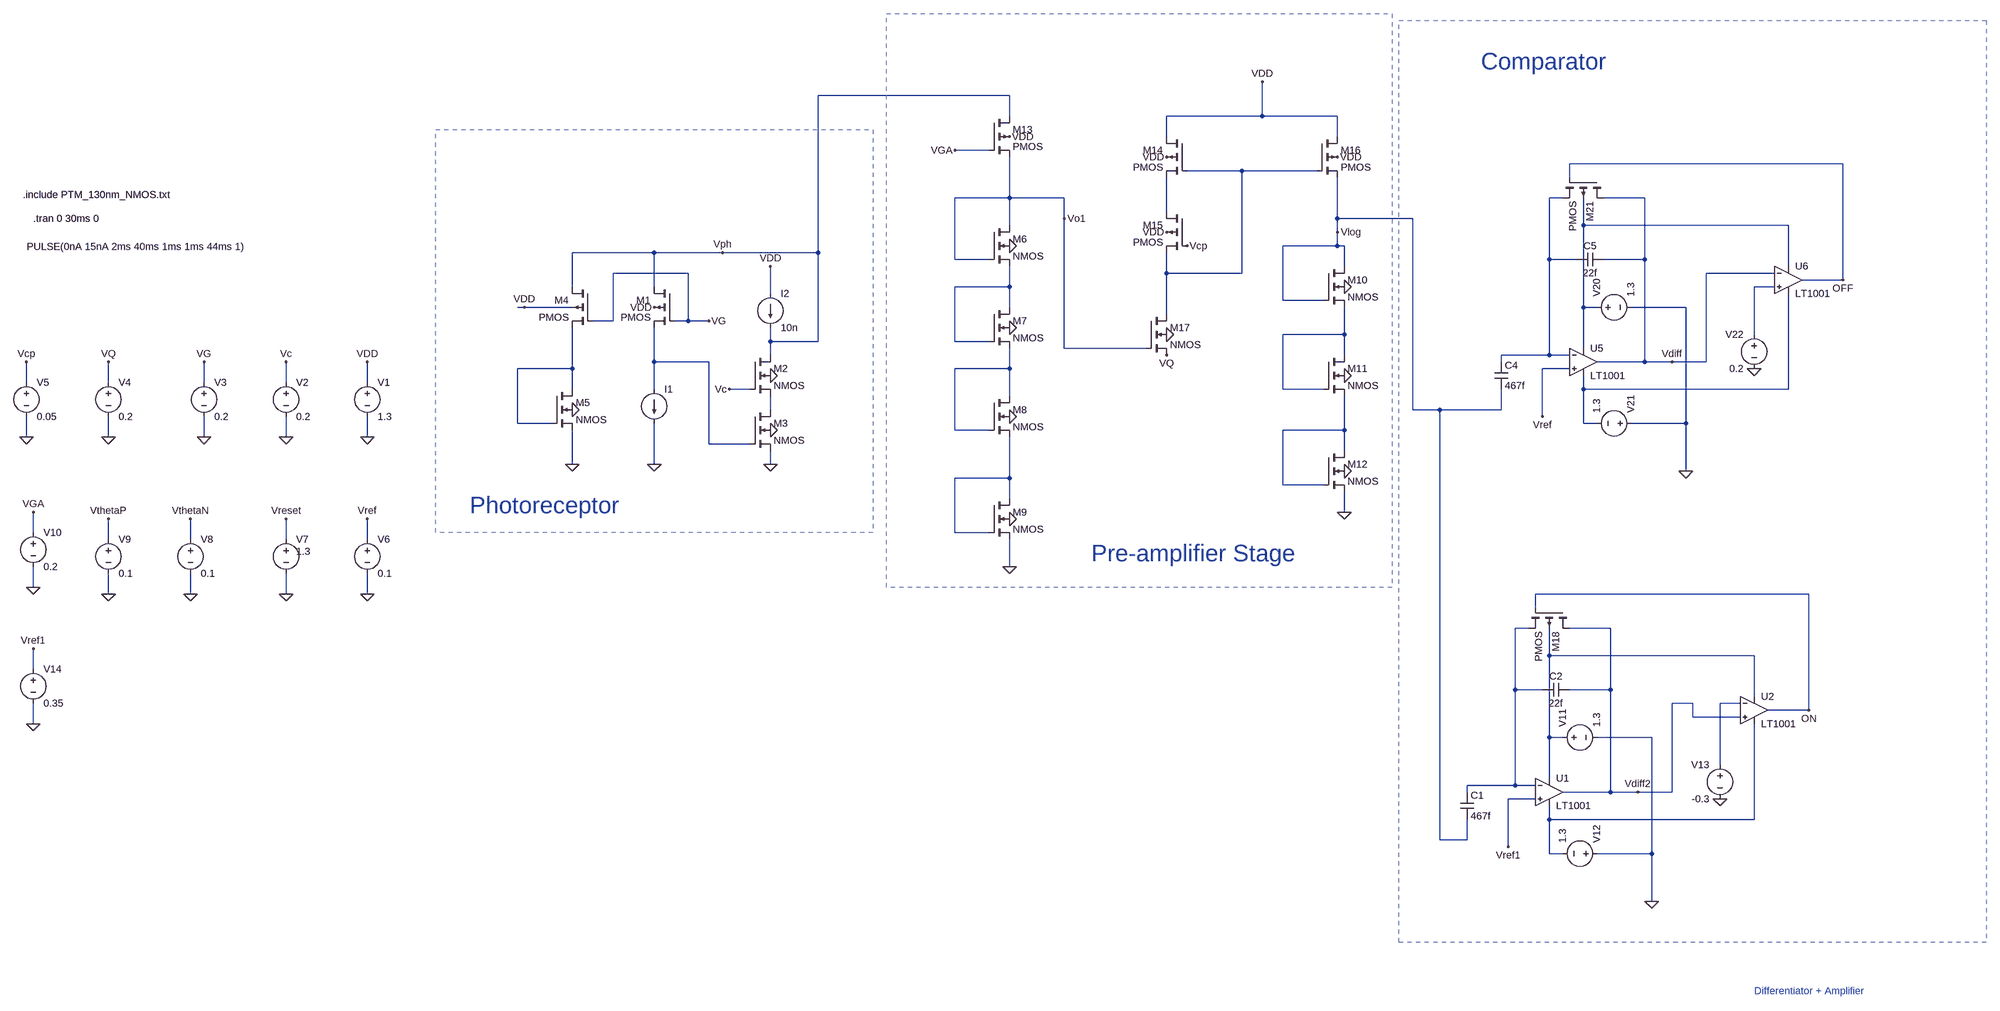
[diagram p0: schematic DAVIS.asc]
DAVIS.asc, the LTspice schematic file:
Version 4
SHEET 1 6216 2696
WIRE 752 -528 304 -528
WIRE 752 -480 752 -528
WIRE 1344 -480 1344 -560
WIRE 1344 -480 1120 -480
WIRE 1520 -480 1344 -480
WIRE 1120 -432 1120 -480
WIRE 1520 -432 1520 -480
WIRE 704 -400 624 -400
WIRE 2704 -368 2064 -368
WIRE 1296 -352 1168 -352
WIRE 1472 -352 1296 -352
WIRE 2064 -336 2064 -368
WIRE 752 -288 752 -384
WIRE 752 -288 624 -288
WIRE 880 -288 752 -288
WIRE 2048 -288 2016 -288
WIRE 2240 -288 2144 -288
WIRE 1120 -256 1120 -336
WIRE 880 -240 880 -288
WIRE 1520 -240 1520 -336
WIRE 1696 -240 1520 -240
WIRE 752 -224 752 -288
WIRE 2096 -224 2096 -288
WIRE 2576 -224 2096 -224
WIRE 1520 -208 1520 -240
WIRE 1520 -176 1520 -208
WIRE 1520 -176 1392 -176
WIRE 1536 -176 1520 -176
WIRE -80 -160 -272 -160
WIRE 80 -160 -80 -160
WIRE 304 -160 304 -528
WIRE 304 -160 80 -160
WIRE 624 -144 624 -288
WIRE 704 -144 624 -144
WIRE 2016 -144 2016 -288
WIRE 2080 -144 2016 -144
WIRE 2240 -144 2240 -288
WIRE 2240 -144 2144 -144
WIRE 1536 -128 1536 -176
WIRE 2576 -128 2576 -224
WIRE 0 -112 -176 -112
WIRE 1120 -112 1120 -160
WIRE 1296 -112 1296 -352
WIRE 1296 -112 1120 -112
WIRE 2544 -112 2384 -112
WIRE 2704 -96 2704 -368
WIRE 2704 -96 2608 -96
WIRE -272 -80 -272 -160
WIRE -80 -80 -80 -160
WIRE 752 -80 752 -128
WIRE 752 -80 624 -80
WIRE 2544 -80 2496 -80
WIRE 192 -64 192 -128
WIRE 1392 -48 1392 -176
WIRE 1488 -48 1392 -48
WIRE -384 -32 -400 -32
WIRE -272 -32 -384 -32
WIRE 752 -32 752 -80
WIRE 2096 -32 2096 -224
WIRE 2128 -32 2096 -32
WIRE 2336 -32 2208 -32
WIRE 1120 -16 1120 -112
WIRE -176 0 -176 -112
WIRE -176 0 -224 0
WIRE 0 0 0 -112
WIRE 0 0 -32 0
WIRE 48 0 0 0
WIRE 1536 32 1536 -32
WIRE 1536 32 1392 32
WIRE 2496 32 2496 -80
WIRE 192 48 192 16
WIRE 304 48 304 -160
WIRE 304 48 192 48
WIRE 624 48 624 -80
WIRE 704 48 624 48
WIRE 880 64 880 -240
WIRE 1072 64 880 64
WIRE 2096 64 2096 -32
WIRE 192 80 192 48
WIRE 1536 80 1536 32
WIRE 2016 80 2016 -144
WIRE 2016 80 1904 80
WIRE 2064 80 2016 80
WIRE -80 96 -80 16
WIRE 48 96 -80 96
WIRE 1904 96 1904 80
WIRE 2240 96 2240 -144
WIRE 2240 96 2128 96
WIRE 2304 96 2240 96
WIRE 2384 96 2384 -112
WIRE 2384 96 2304 96
WIRE -272 112 -272 16
WIRE -272 112 -400 112
WIRE 752 112 752 64
WIRE 752 112 624 112
WIRE 2064 112 2000 112
WIRE -1632 144 -1632 96
WIRE -1440 144 -1440 96
WIRE -1216 144 -1216 96
WIRE -1024 144 -1024 96
WIRE -832 144 -832 96
WIRE -272 160 -272 112
WIRE -80 160 -80 96
WIRE 144 160 96 160
WIRE 1392 160 1392 32
WIRE 1488 160 1392 160
WIRE 2096 160 2096 128
WIRE 2576 160 2576 -64
WIRE 2576 160 2096 160
WIRE 752 176 752 112
WIRE 192 208 192 176
WIRE 1696 208 1696 -240
WIRE 1760 208 1696 208
WIRE 1904 208 1904 160
WIRE 1904 208 1760 208
WIRE 2000 224 2000 112
WIRE -400 240 -400 112
WIRE -320 240 -400 240
WIRE 2096 240 2096 160
WIRE 2128 240 2096 240
WIRE 2336 240 2336 -32
WIRE 2336 240 2208 240
WIRE 624 256 624 112
WIRE 704 256 624 256
WIRE 1536 256 1536 176
WIRE 1536 256 1392 256
WIRE -1632 272 -1632 224
WIRE -1440 272 -1440 224
WIRE -1216 272 -1216 224
WIRE -1024 272 -1024 224
WIRE -832 272 -832 224
WIRE 48 288 48 96
WIRE 144 288 48 288
WIRE 1536 304 1536 256
WIRE -272 336 -272 256
WIRE -80 336 -80 240
WIRE 192 336 192 304
WIRE 2336 352 2336 240
WIRE 752 368 752 272
WIRE 752 368 624 368
WIRE 1392 384 1392 256
WIRE 1488 384 1392 384
WIRE 752 416 752 368
WIRE 1536 448 1536 400
WIRE -1616 496 -1616 448
WIRE 624 496 624 368
WIRE 704 496 624 496
WIRE -1440 512 -1440 464
WIRE -1248 512 -1248 464
WIRE -1024 512 -1024 464
WIRE -832 512 -832 464
WIRE 752 576 752 512
WIRE -1616 624 -1616 576
WIRE -1440 640 -1440 592
WIRE -1248 640 -1248 592
WIRE -1024 640 -1024 592
WIRE -832 640 -832 592
WIRE 2624 640 1984 640
WIRE 1984 672 1984 640
WIRE 1968 720 1936 720
WIRE 2160 720 2064 720
WIRE 2016 784 2016 720
WIRE 2496 784 2016 784
WIRE -1616 816 -1616 768
WIRE 1936 864 1936 720
WIRE 2000 864 1936 864
WIRE 2160 864 2160 720
WIRE 2160 864 2064 864
WIRE 2496 880 2496 784
WIRE 2352 896 2304 896
WIRE 2464 896 2416 896
WIRE 2624 912 2624 640
WIRE 2624 912 2528 912
WIRE 2352 928 2352 896
WIRE 2464 928 2352 928
WIRE -1616 944 -1616 896
WIRE 2016 976 2016 784
WIRE 2048 976 2016 976
WIRE 2256 976 2128 976
WIRE 2416 1040 2416 896
WIRE 2016 1072 2016 976
WIRE 1936 1088 1936 864
WIRE 1936 1088 1824 1088
WIRE 1984 1088 1936 1088
WIRE 1824 1104 1824 1088
WIRE 2160 1104 2160 864
WIRE 2160 1104 2048 1104
WIRE 2224 1104 2160 1104
WIRE 2304 1104 2304 896
WIRE 2304 1104 2224 1104
WIRE 1984 1120 1920 1120
WIRE 2016 1168 2016 1136
WIRE 2496 1168 2496 944
WIRE 2496 1168 2016 1168
WIRE 1760 1216 1760 208
WIRE 1824 1216 1824 1168
WIRE 1824 1216 1760 1216
WIRE 1920 1232 1920 1120
WIRE 2016 1248 2016 1168
WIRE 2048 1248 2016 1248
WIRE 2256 1248 2256 976
WIRE 2256 1248 2128 1248
WIRE 2256 1360 2256 1248
FLAG -272 336 0
FLAG -80 336 0
FLAG 192 336 0
FLAG 192 256 0
FLAG 192 128 0
FLAG -272 208 0
FLAG 48 0 VG
FLAG 96 160 Vc
FLAG 192 -128 VDD
FLAG -1216 272 0
FLAG -1024 272 0
FLAG -832 272 0
FLAG -1216 96 VG
FLAG -1024 96 Vc
FLAG -832 96 VDD
FLAG 624 -400 VGA
FLAG -384 -32 VDD
FLAG -80 -32 VDD
FLAG 752 -432 VDD
FLAG 1120 -384 VDD
FLAG 1520 -384 VDD
FLAG 1120 -208 VDD
FLAG 752 -176 0
FLAG 752 16 0
FLAG 752 224 0
FLAG 752 464 0
FLAG 1536 128 0
FLAG 1536 -80 0
FLAG 1536 352 0
FLAG 1536 448 0
FLAG 752 576 0
FLAG 1168 -176 Vcp
FLAG 1520 -208 Vlog
FLAG 1120 80 VQ
FLAG 1120 32 0
FLAG 1344 -560 VDD
FLAG -1440 272 0
FLAG -1440 96 VQ
FLAG -1632 272 0
FLAG -1632 96 Vcp
FLAG -832 640 0
FLAG -832 464 Vref
FLAG -1024 640 0
FLAG 2304 96 Vdiff
FLAG 80 -160 Vph
FLAG -1248 640 0
FLAG -1248 464 VthetaN
FLAG -1440 640 0
FLAG -1440 464 VthetaP
FLAG 880 -240 Vo1
FLAG -1616 624 0
FLAG -1616 448 VGA
FLAG -1024 464 Vreset
FLAG 2000 224 Vref
FLAG 2336 352 0
FLAG 2496 112 0
FLAG 2704 -96 OFF
FLAG 2224 1104 Vdiff2
FLAG 1920 1232 Vref1
FLAG 2256 1360 0
FLAG 2416 1120 0
FLAG 2624 912 ON
FLAG -1616 944 0
FLAG -1616 768 Vref1
SYMBOL pmos4 -32 -80 M0
SYMATTR InstName M1
SYMATTR Value2 l=130nm w=130nm
SYMBOL nmos4 144 80 R0
SYMATTR InstName M2
SYMATTR Value2 l=130nm w=130nm
SYMBOL nmos4 144 208 R0
SYMATTR InstName M3
SYMATTR Value2 l=130nm w=130nm
SYMBOL current -80 160 R0
WINDOW 3 -1551 -334 Left 2
WINDOW 123 0 0 Left 0
WINDOW 39 0 0 Left 0
SYMATTR Value PULSE(0nA 15nA 2ms 40ms 1ms 1ms 44ms 1)
SYMATTR InstName I1
SYMBOL current 192 -64 R0
WINDOW 123 0 0 Left 0
WINDOW 39 0 0 Left 0
SYMATTR InstName I2
SYMATTR Value 10n
SYMBOL pmos4 -224 -80 M0
SYMATTR InstName M4
SYMATTR Value2 l=130nm w=130nm
SYMBOL nmos4 -320 160 R0
SYMATTR InstName M5
SYMATTR Value2 l=130nm w=130nm
SYMBOL voltage -832 128 R0
WINDOW 123 0 0 Left 0
WINDOW 39 0 0 Left 0
SYMATTR InstName V1
SYMATTR Value 1.3
SYMBOL voltage -1024 128 R0
WINDOW 123 0 0 Left 0
WINDOW 39 0 0 Left 0
SYMATTR InstName V2
SYMATTR Value 0.2
SYMBOL voltage -1216 128 R0
WINDOW 123 0 0 Left 0
WINDOW 39 0 0 Left 0
SYMATTR InstName V3
SYMATTR Value 0.2
SYMBOL nmos4 704 -224 R0
SYMATTR InstName M6
SYMBOL nmos4 704 -32 R0
SYMATTR InstName M7
SYMBOL nmos4 704 176 R0
SYMATTR InstName M8
SYMBOL nmos4 704 416 R0
SYMATTR InstName M9
SYMBOL nmos4 1488 -128 R0
SYMATTR InstName M10
SYMATTR Value2 l=130nm w=130nm
SYMBOL nmos4 1488 80 R0
SYMATTR InstName M11
SYMATTR Value2 l=130nm w=130nm
SYMBOL nmos4 1488 304 R0
SYMATTR InstName M12
SYMATTR Value2 l=130nm w=130nm
SYMBOL pmos4 704 -480 R0
SYMATTR InstName M13
SYMBOL pmos4 1168 -432 M0
SYMATTR InstName M14
SYMATTR Value2 l=130nm w=130nm
SYMBOL pmos4 1168 -256 M0
SYMATTR InstName M15
SYMATTR Value2 l=130nm w=130nm
SYMBOL pmos4 1472 -432 R0
SYMATTR InstName M16
SYMATTR Value2 l=130nm w=130nm
SYMBOL nmos4 1072 -16 R0
SYMATTR InstName M17
SYMATTR Value2 l=130nm w=130nm
SYMBOL voltage -1440 128 R0
WINDOW 123 0 0 Left 0
WINDOW 39 0 0 Left 0
SYMATTR InstName V4
SYMATTR Value 0.2
SYMBOL voltage -1632 128 R0
WINDOW 123 0 0 Left 0
WINDOW 39 0 0 Left 0
SYMATTR InstName V5
SYMATTR Value 0.05
SYMBOL voltage -832 496 R0
WINDOW 123 0 0 Left 0
WINDOW 39 0 0 Left 0
SYMATTR InstName V6
SYMATTR Value 0.1
SYMBOL voltage -1024 496 R0
WINDOW 123 0 0 Left 0
WINDOW 39 0 0 Left 0
WINDOW 3 24 44 Left 2
SYMATTR Value 1.3
SYMATTR InstName V7
SYMBOL voltage -1248 496 R0
WINDOW 123 0 0 Left 0
WINDOW 39 0 0 Left 0
SYMATTR InstName V8
SYMATTR Value 0.1
SYMBOL voltage -1440 496 R0
WINDOW 123 0 0 Left 0
WINDOW 39 0 0 Left 0
SYMATTR InstName V9
SYMATTR Value 0.1
SYMBOL voltage -1616 480 R0
WINDOW 123 0 0 Left 0
WINDOW 39 0 0 Left 0
SYMATTR InstName V10
SYMATTR Value 0.2
SYMBOL OpAmps\\LT1001 2096 32 R0
SYMATTR InstName U5
SYMBOL cap 1888 96 R0
SYMATTR InstName C4
SYMATTR Value 467f
SYMBOL cap 2144 -160 R90
WINDOW 0 0 32 VBottom 2
WINDOW 3 32 32 VTop 2
SYMATTR InstName C5
SYMATTR Value 22f
SYMBOL voltage 2112 -32 R270
WINDOW 123 0 0 Left 0
WINDOW 39 0 0 Left 0
SYMATTR InstName V20
SYMATTR Value 1.3
SYMBOL voltage 2224 240 M270
WINDOW 123 0 0 Left 0
WINDOW 39 0 0 Left 0
SYMATTR InstName V21
SYMATTR Value 1.3
SYMBOL pmos4 2144 -336 R90
SYMATTR InstName M21
SYMBOL OpAmps\\LT1001 2576 -160 R0
SYMATTR InstName U6
SYMBOL voltage 2496 16 M0
WINDOW 123 0 0 Left 0
WINDOW 39 0 0 Left 0
SYMATTR InstName V22
SYMATTR Value 0.2
SYMBOL OpAmps\\LT1001 2016 1040 R0
SYMATTR InstName U1
SYMBOL cap 1808 1104 R0
SYMATTR InstName C1
SYMATTR Value 467f
SYMBOL cap 2064 848 R90
WINDOW 0 0 32 VBottom 2
WINDOW 3 32 32 VTop 2
SYMATTR InstName C2
SYMATTR Value 22f
SYMBOL voltage 2032 976 R270
WINDOW 123 0 0 Left 0
WINDOW 39 0 0 Left 0
SYMATTR InstName V11
SYMATTR Value 1.3
SYMBOL voltage 2144 1248 M270
WINDOW 123 0 0 Left 0
WINDOW 39 0 0 Left 0
SYMATTR InstName V12
SYMATTR Value 1.3
SYMBOL pmos4 2064 672 R90
SYMATTR InstName M18
SYMBOL OpAmps\\LT1001 2496 848 R0
SYMATTR InstName U2
SYMBOL voltage 2416 1024 M0
WINDOW 123 0 0 Left 0
WINDOW 39 0 0 Left 0
SYMATTR InstName V13
SYMATTR Value -0.3
SYMBOL voltage -1616 800 R0
WINDOW 123 0 0 Left 0
WINDOW 39 0 0 Left 0
SYMATTR InstName V14
SYMATTR Value 0.35
TEXT -1640 -296 Left 2 !.include PTM_130nm_NMOS.txt
TEXT -1616 -240 Left 2 !.tran 0 30ms 0
TEXT -512 432 Left 5 ;Photoreceptor
TEXT 944 544 Left 5 ;Pre-amplifier Stage
TEXT 2496 2680 Left 2 ;Differentiator + Amplifier
TEXT 1856 -608 Left 5 ;Comparator
RECTANGLE Normal 432 496 -592 -448 2
RECTANGLE Normal 1648 624 464 -720 2
RECTANGLE Normal 3040 1456 1664 -704 2

The netlist it stands for:
* DAVIS.asc
M1 Vph VG N008 VDD PMOS l=130nm w=130nm
M2 Vph Vc N012 0 NMOS l=130nm w=130nm
M3 N012 N008 0 0 NMOS l=130nm w=130nm
I1 N008 0 PULSE(0nA 15nA 2ms 40ms 1ms 1ms 44ms 1)
I2 VDD Vph 10n
M4 Vph VG N009 VDD PMOS l=130nm w=130nm
M5 N009 N009 0 0 NMOS l=130nm w=130nm
V1 VDD 0 1.3
V2 Vc 0 0.2
V3 VG 0 0.2
M6 Vo1 Vo1 N005 0 NMOS
M7 N005 N005 N010 0 NMOS
M8 N010 N010 N014 0 NMOS
M9 N014 N014 0 0 NMOS
M10 Vlog Vlog N007 0 NMOS l=130nm w=130nm
M11 N007 N007 N013 0 NMOS l=130nm w=130nm
M12 N013 N013 0 0 NMOS l=130nm w=130nm
M13 Vph VGA Vo1 VDD PMOS
M14 VDD N001 N003 VDD PMOS l=130nm w=130nm
M15 N003 Vcp N001 VDD PMOS l=130nm w=130nm
M16 VDD N001 Vlog VDD PMOS l=130nm w=130nm
M17 N001 Vo1 VQ 0 NMOS l=130nm w=130nm
V4 VQ 0 0.2
V5 Vcp 0 0.05
V6 Vref 0 0.1
V7 Vreset 0 1.3
V8 VthetaN 0 0.1
V9 VthetaP 0 0.1
V10 VGA 0 0.2
XU5 Vref N002 N004 N011 Vdiff LT1001  ; pins In+ In- V+ V- OUT
C4 N002 Vlog 467f
C5 Vdiff N002 22f
V20 N004 0 1.3
V21 0 N011 1.3
M21 Vdiff OFF N002 N004 PMOS
XU6 N006 Vdiff N004 N011 OFF LT1001  ; pins In+ In- V+ V- OUT
V22 N006 0 0.2
XU1 Vref1 N015 N016 N018 Vdiff2 LT1001  ; pins In+ In- V+ V- OUT
C1 N015 Vlog 467f
C2 Vdiff2 N015 22f
V11 N016 0 1.3
V12 0 N018 1.3
M18 Vdiff2 ON N015 N016 PMOS
XU2 Vdiff2 N017 N016 N018 ON LT1001  ; pins In+ In- V+ V- OUT
V13 N017 0 -0.3
V14 Vref1 0 0.35
.model NMOS NMOS
.model PMOS PMOS
.lib standard.mos
.include PTM_130nm_NMOS.txt
.tran 0 30ms 0
* Photoreceptor
* Pre-amplifier Stage
* Differentiator + Amplifier
* Comparator
.lib LTC.lib
.backanno
.end